# EAGLE schematic rpi-sstv (EAGLE 6.4)
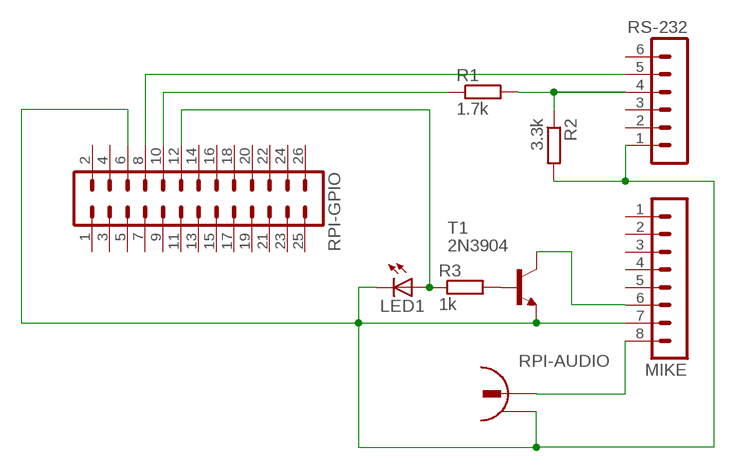
[diagram p0: schematic, sheet 1]

## Parts
LED1  LED5MM  [LED5MM]
MIKE  MA08-1  [MA08-1]
R1  1.7k  R-EU_0411/15  [0411/15]
R2  3.3k  R-EU_0411/15  [0411/15]
R3  1k  R-EU_0411/15  [0411/15]
RPI-AUDIO  736880-49  [736880-49]
RPI-GPIO  MA13-2  [MA13-2]
RS-232  MA06-1  [MA06-1]
T1  2N3904  [TO92]

## Nets
N$1: R3.2 T1.2(B)
N$2: LED1.A R3.1 RPI-GPIO.12
N$3: R1.2 R2.1 RS-232.4
N$4: MIKE.6 T1.1(C)
N$5: MIKE.8 RPI-AUDIO.1
N$6: R1.1 RPI-GPIO.10
N$9: LED1.K(C) MIKE.7 R2.2 RPI-AUDIO.2 RPI-GPIO.6 RS-232.1 T1.3(E)
N$10: RPI-GPIO.8 RS-232.5
Unconnected: MIKE.1 MIKE.2 MIKE.3 MIKE.4 MIKE.5 RPI-AUDIO.2@2 RPI-GPIO.1 RPI-GPIO.2 RPI-GPIO.3 RPI-GPIO.4 RPI-GPIO.5 RPI-GPIO.7 RPI-GPIO.9 RPI-GPIO.11 RPI-GPIO.13 RPI-GPIO.14 RPI-GPIO.15 RPI-GPIO.16 RPI-GPIO.17 RPI-GPIO.18 RPI-GPIO.19 RPI-GPIO.20 RPI-GPIO.21 RPI-GPIO.22 RPI-GPIO.23 RPI-GPIO.24 RPI-GPIO.25 RPI-GPIO.26 RS-232.2 RS-232.3 RS-232.6

## Library data of the parts
LED1 = led:LED: LED OSRAM: - CHIPLED LG R971, LG N971, LY N971, LG Q971, LY Q971, LO R971, LY R971 LH N974, LH R974 LS Q976, LO Q976, LY Q976 LO Q996 - Hyper CHIPLED LW Q18S LB Q993, LB Q99A, LB R99A - SideLED LS A670, LO A670, LY A670, LG A670, LP A670 LB A673, LV A673, LT A673, LW A673 LH A674 LY A675 LS A676, LA A676, LO A676, LY A676, LW A676 LS A679, LY A679, LG A679 - Hyper Micro SIDELED® LS Y876, LA Y876, LO Y876, LY Y876 LT Y87S - SmartLED LW L88C, LW L88S LB L89C, LB L89S, LG L890 LS L89K, LO L89K, LY L89K LS L896, LA L896, LO L896, LY L896 - TOPLED LS T670, LO T670, LY T670, LG T670, LP T670 LSG T670, LSP T670, LSY T670, LOP T670, LYG T670 LG T671, LOG T671, LSG T671 LB T673, LV T673, LT T673, LW T673 LH T674 LS T676, LA T676, LO T676, LY T676, LB T676, LH T676, LSB T676, LW T676 LB T67C, LV T67C, LT T67C, LS T67K, LO T67K, LY T67K, LW E67C LS E67B, LA E67B, LO E67B, LY E67B, LB E67C, LV E67C, LT E67C LW T67C LS T679, LY T679, LG T679 LS T770, LO T770, LY T770, LG T770, LP T770 LB T773, LV T773, LT T773, LW T773 LH T774 LS E675, LA E675, LY E675, LS T675 LS T776, LA T776, LO T776, LY T776, LB T776 LHGB T686 LT T68C, LB T68C - Hyper Mini TOPLED® LB M676 - Mini TOPLED Santana® LG M470 LS M47K, LO M47K, LY M47K Source: http://www.osram.convergy.de LUXEON: - LUMILED® LXK2-PW12-R00, LXK2-PW12-S00, LXK2-PW14-U00, LXK2-PW14-V00 LXK2-PM12-R00, LXK2-PM12-S00, LXK2-PM14-U00 LXK2-PE12-Q00, LXK2-PE12-R00, LXK2-PE12-S00, LXK2-PE14-T00, LXK2-PE14-U00 LXK2-PB12-K00, LXK2-PB12-L00, LXK2-PB12-M00, LXK2-PB14-N00, LXK2-PB14-P00, LXK2-PB14-Q00 LXK2-PR12-L00, LXK2-PR12-M00, LXK2-PR14-Q00, LXK2-PR14-R00 LXK2-PD12-Q00, LXK2-PD12-R00, LXK2-PD12-S00 LXK2-PH12-R00, LXK2-PH12-S00 LXK2-PL12-P00, LXK2-PL12-Q00, LXK2-PL12-R00 Source: www.luxeon.com KINGBRIGHT: KA-3528ASYC Source: www.kingbright.com
MIKE = con-lstb:MA08-1: PIN HEADER; OC_FARNELL: unknown; OC_NEWARK: unknown
R1-R3 = resistor:R-EU_: RESISTOR, European symbol
RPI-AUDIO = con-conrad:736880-49: Cinch Connector ( RCA Jack )
RPI-GPIO = con-lstb:MA13-2: PIN HEADER; OC_FARNELL: unknown; OC_NEWARK: unknown
RS-232 = con-lstb:MA06-1: PIN HEADER; OC_FARNELL: unknown; OC_NEWARK: unknown
T1 = transistor:2N3904: NPN TRANSISTOR